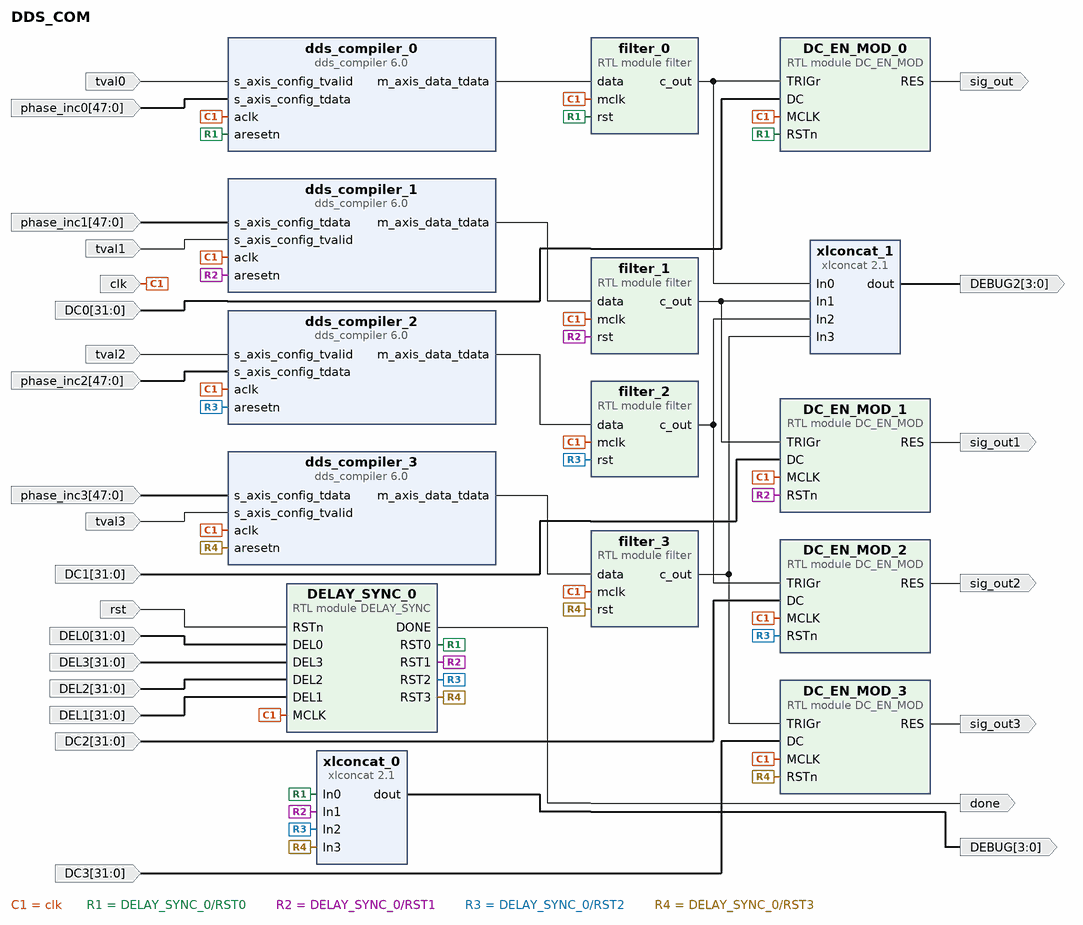
[diagram p0: block diagram of the top level]
# Vivado block design DDS_COM, xc7z020clg400-1, Vivado 2019.1
create_bd_design DDS_COM

create_bd_port -dir I -from 47 -to 0 phase_inc0
create_bd_port -dir I clk
create_bd_port -dir I rst
create_bd_port -dir I tval0
create_bd_port -dir O sig_out
create_bd_port -dir I -from 47 -to 0 phase_inc1
create_bd_port -dir I tval1
create_bd_port -dir O sig_out1
create_bd_port -dir I -from 47 -to 0 phase_inc2
create_bd_port -dir I tval2
create_bd_port -dir O sig_out2
create_bd_port -dir I -from 47 -to 0 phase_inc3
create_bd_port -dir O sig_out3
create_bd_port -dir I tval3
create_bd_port -dir I -from 31 -to 0 DEL0
create_bd_port -dir I -from 31 -to 0 DEL1
create_bd_port -dir I -from 31 -to 0 DEL2
create_bd_port -dir I -from 31 -to 0 DEL3
create_bd_port -dir O done
create_bd_port -dir I -from 31 -to 0 DC0
create_bd_port -dir I -from 31 -to 0 DC1
create_bd_port -dir I -from 31 -to 0 DC2
create_bd_port -dir I -from 31 -to 0 DC3
create_bd_port -dir O -from 3 -to 0 DEBUG
create_bd_port -dir O -from 3 -to 0 DEBUG2

create_bd_cell -type ip -vlnv xilinx.com:ip:dds_compiler:6.0 dds_compiler_0
set_property -dict [list \
  CONFIG.Amplitude_Mode Unit_Circle \
  CONFIG.Channels 1 \
  CONFIG.DATA_Has_TLAST Not_Required \
  CONFIG.DDS_Clock_Rate 460 \
  CONFIG.Frequency_Resolution 1.64869e-6 \
  CONFIG.Has_ARESETn true \
  CONFIG.Has_Phase_Out false \
  CONFIG.Latency 6 \
  CONFIG.M_DATA_Has_TUSER Not_Required \
  CONFIG.M_PHASE_Has_TUSER Not_Required \
  CONFIG.Mode_of_Operation Standard \
  CONFIG.Noise_Shaping None \
  CONFIG.Output_Frequency1 0 \
  CONFIG.Output_Selection Sine \
  CONFIG.Output_Width 8 \
  CONFIG.PINC1 1000110100111000111000100110100011111011 \
  CONFIG.POFF1 100000000000000000000000000000000000000000000000 \
  CONFIG.Parameter_Entry Hardware_Parameters \
  CONFIG.PartsPresent Phase_Generator_and_SIN_COS_LUT \
  CONFIG.Phase_Increment Programmable \
  CONFIG.Phase_Width 48 \
  CONFIG.Phase_offset Fixed \
  CONFIG.S_PHASE_Has_TUSER Not_Required \
] [get_bd_cells dds_compiler_0]
create_bd_cell -type ip -vlnv xilinx.com:ip:dds_compiler:6.0 dds_compiler_1
set_property -dict [list \
  CONFIG.Amplitude_Mode Unit_Circle \
  CONFIG.Channels 1 \
  CONFIG.DATA_Has_TLAST Not_Required \
  CONFIG.DDS_Clock_Rate 460 \
  CONFIG.Frequency_Resolution 0.4 \
  CONFIG.Has_ARESETn true \
  CONFIG.Has_Phase_Out false \
  CONFIG.Latency 6 \
  CONFIG.M_DATA_Has_TUSER Not_Required \
  CONFIG.M_PHASE_Has_TUSER Not_Required \
  CONFIG.Mode_of_Operation Standard \
  CONFIG.Noise_Shaping None \
  CONFIG.Output_Frequency1 0 \
  CONFIG.Output_Selection Sine \
  CONFIG.Output_Width 8 \
  CONFIG.PINC1 10001101001110001110001001101000111110110 \
  CONFIG.POFF1 100000000000000000000000000000000000000000000000 \
  CONFIG.Parameter_Entry Hardware_Parameters \
  CONFIG.PartsPresent Phase_Generator_and_SIN_COS_LUT \
  CONFIG.Phase_Increment Programmable \
  CONFIG.Phase_Width 48 \
  CONFIG.Phase_offset Fixed \
  CONFIG.S_PHASE_Has_TUSER Not_Required \
] [get_bd_cells dds_compiler_1]
create_bd_cell -type ip -vlnv xilinx.com:ip:dds_compiler:6.0 dds_compiler_2
set_property -dict [list \
  CONFIG.Amplitude_Mode Unit_Circle \
  CONFIG.Channels 1 \
  CONFIG.DATA_Has_TLAST Not_Required \
  CONFIG.DDS_Clock_Rate 460 \
  CONFIG.Frequency_Resolution 0.4 \
  CONFIG.Has_ARESETn true \
  CONFIG.Has_Phase_Out false \
  CONFIG.Latency 6 \
  CONFIG.M_DATA_Has_TUSER Not_Required \
  CONFIG.M_PHASE_Has_TUSER Not_Required \
  CONFIG.Mode_of_Operation Standard \
  CONFIG.Noise_Shaping None \
  CONFIG.Output_Frequency1 0 \
  CONFIG.Output_Selection Sine \
  CONFIG.Output_Width 8 \
  CONFIG.PINC1 10001101001110001110001001101000111110110 \
  CONFIG.POFF1 100000000000000000000000000000000000000000000000 \
  CONFIG.Parameter_Entry Hardware_Parameters \
  CONFIG.PartsPresent Phase_Generator_and_SIN_COS_LUT \
  CONFIG.Phase_Increment Programmable \
  CONFIG.Phase_Width 48 \
  CONFIG.Phase_offset Fixed \
  CONFIG.S_PHASE_Has_TUSER Not_Required \
] [get_bd_cells dds_compiler_2]
create_bd_cell -type ip -vlnv xilinx.com:ip:dds_compiler:6.0 dds_compiler_3
set_property -dict [list \
  CONFIG.Amplitude_Mode Unit_Circle \
  CONFIG.Channels 1 \
  CONFIG.DATA_Has_TLAST Not_Required \
  CONFIG.DDS_Clock_Rate 460 \
  CONFIG.Frequency_Resolution 0.4 \
  CONFIG.Has_ARESETn true \
  CONFIG.Has_Phase_Out false \
  CONFIG.Latency 6 \
  CONFIG.M_DATA_Has_TUSER Not_Required \
  CONFIG.M_PHASE_Has_TUSER Not_Required \
  CONFIG.Mode_of_Operation Standard \
  CONFIG.Noise_Shaping None \
  CONFIG.Output_Frequency1 0 \
  CONFIG.Output_Selection Sine \
  CONFIG.Output_Width 8 \
  CONFIG.PINC1 10001101001110001110001001101000111110110 \
  CONFIG.POFF1 100000000000000000000000000000000000000000000000 \
  CONFIG.Parameter_Entry Hardware_Parameters \
  CONFIG.PartsPresent Phase_Generator_and_SIN_COS_LUT \
  CONFIG.Phase_Increment Programmable \
  CONFIG.Phase_Width 48 \
  CONFIG.Phase_offset Fixed \
  CONFIG.S_PHASE_Has_TUSER Not_Required \
] [get_bd_cells dds_compiler_3]
create_bd_cell -type module -reference filter filter_0
create_bd_cell -type module -reference filter filter_1
create_bd_cell -type module -reference filter filter_2
create_bd_cell -type module -reference filter filter_3
create_bd_cell -type module -reference DELAY_SYNC DELAY_SYNC_0
create_bd_cell -type ip -vlnv xilinx.com:ip:xlconcat:2.1 xlconcat_0
set_property -dict {CONFIG.NUM_PORTS 4} [get_bd_cells xlconcat_0]
create_bd_cell -type ip -vlnv xilinx.com:ip:xlconcat:2.1 xlconcat_1
set_property -dict {CONFIG.NUM_PORTS 4} [get_bd_cells xlconcat_1]
create_bd_cell -type module -reference DC_EN_MOD DC_EN_MOD_0
create_bd_cell -type module -reference DC_EN_MOD DC_EN_MOD_1
create_bd_cell -type module -reference DC_EN_MOD DC_EN_MOD_2
create_bd_cell -type module -reference DC_EN_MOD DC_EN_MOD_3

# ---- connections ----

connect_bd_net [get_bd_ports clk] \
  [get_bd_pins dds_compiler_0/aclk] [get_bd_pins dds_compiler_1/aclk] [get_bd_pins dds_compiler_2/aclk] \
  [get_bd_pins dds_compiler_3/aclk] [get_bd_pins filter_0/mclk] [get_bd_pins filter_1/mclk] [get_bd_pins filter_2/mclk] \
  [get_bd_pins filter_3/mclk] [get_bd_pins DELAY_SYNC_0/MCLK] [get_bd_pins DC_EN_MOD_0/MCLK] [get_bd_pins DC_EN_MOD_1/MCLK] \
  [get_bd_pins DC_EN_MOD_2/MCLK] [get_bd_pins DC_EN_MOD_3/MCLK]
connect_bd_net [get_bd_ports tval0] [get_bd_pins dds_compiler_0/s_axis_config_tvalid]
connect_bd_net [get_bd_pins dds_compiler_0/m_axis_data_tdata] [get_bd_pins filter_0/data]
connect_bd_net [get_bd_pins dds_compiler_1/m_axis_data_tdata] [get_bd_pins filter_1/data]
connect_bd_net [get_bd_ports phase_inc0] [get_bd_pins dds_compiler_0/s_axis_config_tdata]
connect_bd_net -net phase_inc1_1 [get_bd_ports phase_inc1] [get_bd_pins dds_compiler_1/s_axis_config_tdata]
connect_bd_net -net tval1_1 [get_bd_ports tval1] [get_bd_pins dds_compiler_1/s_axis_config_tvalid]
connect_bd_net [get_bd_pins dds_compiler_2/m_axis_data_tdata] [get_bd_pins filter_2/data]
connect_bd_net -net tval2_1 [get_bd_ports tval2] [get_bd_pins dds_compiler_2/s_axis_config_tvalid]
connect_bd_net -net phase_inc2_1 [get_bd_ports phase_inc2] [get_bd_pins dds_compiler_2/s_axis_config_tdata]
connect_bd_net -net phase_inc3_1 [get_bd_ports phase_inc3] [get_bd_pins dds_compiler_3/s_axis_config_tdata]
connect_bd_net -net tval3_1 [get_bd_ports tval3] [get_bd_pins dds_compiler_3/s_axis_config_tvalid]
connect_bd_net [get_bd_pins dds_compiler_3/m_axis_data_tdata] [get_bd_pins filter_3/data]
connect_bd_net [get_bd_pins DELAY_SYNC_0/RST0] \
  [get_bd_pins dds_compiler_0/aresetn] [get_bd_pins filter_0/rst] [get_bd_pins xlconcat_0/In0] [get_bd_pins DC_EN_MOD_0/RSTn]
connect_bd_net [get_bd_pins DELAY_SYNC_0/RST1] \
  [get_bd_pins dds_compiler_1/aresetn] [get_bd_pins filter_1/rst] [get_bd_pins xlconcat_0/In1] [get_bd_pins DC_EN_MOD_1/RSTn]
connect_bd_net [get_bd_pins DELAY_SYNC_0/RST2] \
  [get_bd_pins dds_compiler_2/aresetn] [get_bd_pins filter_2/rst] [get_bd_pins xlconcat_0/In2] [get_bd_pins DC_EN_MOD_2/RSTn]
connect_bd_net [get_bd_pins DELAY_SYNC_0/RST3] \
  [get_bd_pins dds_compiler_3/aresetn] [get_bd_pins filter_3/rst] [get_bd_pins xlconcat_0/In3] [get_bd_pins DC_EN_MOD_3/RSTn]
connect_bd_net [get_bd_ports rst] [get_bd_pins DELAY_SYNC_0/RSTn]
connect_bd_net -net DEL0_1 [get_bd_ports DEL0] [get_bd_pins DELAY_SYNC_0/DEL0]
connect_bd_net -net DEL3_1 [get_bd_ports DEL3] [get_bd_pins DELAY_SYNC_0/DEL3]
connect_bd_net -net DEL2_1 [get_bd_ports DEL2] [get_bd_pins DELAY_SYNC_0/DEL2]
connect_bd_net -net DEL1_1 [get_bd_ports DEL1] [get_bd_pins DELAY_SYNC_0/DEL1]
connect_bd_net [get_bd_pins filter_1/c_out] [get_bd_pins xlconcat_1/In1] [get_bd_pins DC_EN_MOD_1/TRIGr]
connect_bd_net [get_bd_pins filter_0/c_out] [get_bd_pins xlconcat_1/In0] [get_bd_pins DC_EN_MOD_0/TRIGr]
connect_bd_net [get_bd_pins filter_2/c_out] [get_bd_pins xlconcat_1/In2] [get_bd_pins DC_EN_MOD_2/TRIGr]
connect_bd_net [get_bd_pins filter_3/c_out] [get_bd_pins xlconcat_1/In3] [get_bd_pins DC_EN_MOD_3/TRIGr]
connect_bd_net [get_bd_pins DC_EN_MOD_1/RES] [get_bd_ports sig_out1]
connect_bd_net [get_bd_pins DC_EN_MOD_0/RES] [get_bd_ports sig_out]
connect_bd_net [get_bd_pins DC_EN_MOD_2/RES] [get_bd_ports sig_out2]
connect_bd_net [get_bd_pins DC_EN_MOD_3/RES] [get_bd_ports sig_out3]
connect_bd_net [get_bd_pins DELAY_SYNC_0/DONE] [get_bd_ports done]
connect_bd_net -net DC0_1 [get_bd_ports DC0] [get_bd_pins DC_EN_MOD_0/DC]
connect_bd_net -net DC1_1 [get_bd_ports DC1] [get_bd_pins DC_EN_MOD_1/DC]
connect_bd_net -net DC2_1 [get_bd_ports DC2] [get_bd_pins DC_EN_MOD_2/DC]
connect_bd_net -net DC3_1 [get_bd_ports DC3] [get_bd_pins DC_EN_MOD_3/DC]
connect_bd_net [get_bd_pins xlconcat_0/dout] [get_bd_ports DEBUG]
connect_bd_net [get_bd_pins xlconcat_1/dout] [get_bd_ports DEBUG2]

validate_bd_design
save_bd_design
